# Altium project negative-join.PrjPcb
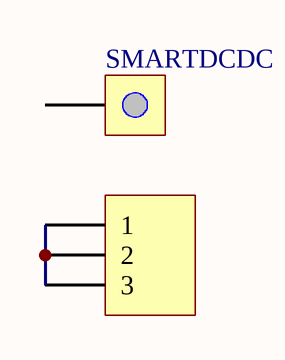
[diagram p0: negative-join.SchDoc]
1 sheet, 2 parts. Net scope: global (net labels, ports and power ports of the same name join across sheets).
Board files: negative-join.PcbDoc, negative-join_faceplace.PcbDoc

## Sheet negative-join.SchDoc
size A4

### Parts
P?  Header 3  [ANDERSON_POWERCLAW_3]  (value not drawn)
SMARTDCDC  TEST  [ANDERSON_MINI]  (value not drawn)

### Nets
NetP?_1: P?.1 P?.2 P?.3

Not connected (* = marked no-connect by the designer): SMARTDCDC 0(TP)

### Library data of the parts
P? = Header 3: Header, 3-Pin; LatestRevisionDate: 17-Jul-2002; LatestRevisionNote: Re-released for DXP Platform.; Publisher: Altium Limited
SMARTDCDC = TEST: TEST POINT